# EAGLE design zhab-duino (EAGLE 7.5.0)
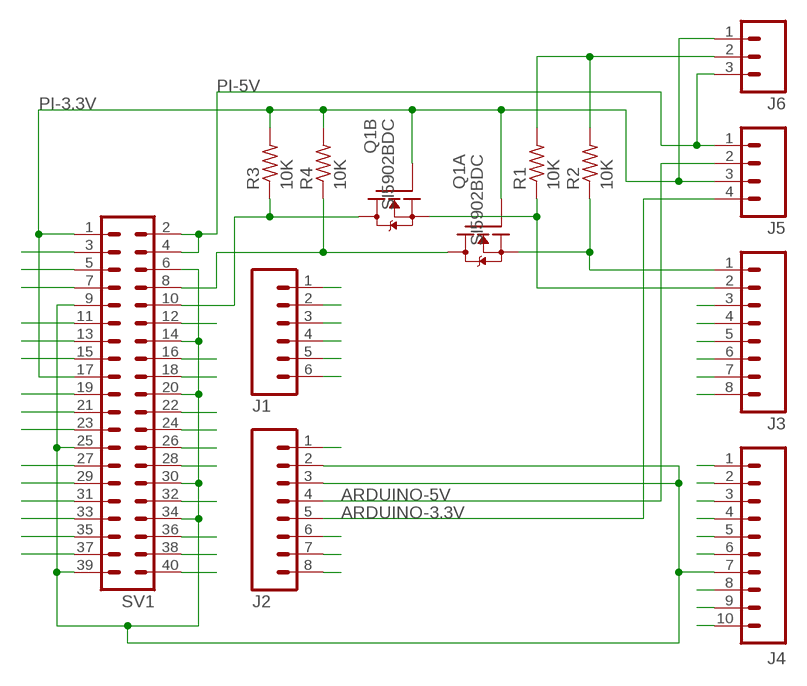
[diagram p0: schematic, sheet 1]

## Parts
J1  M06NO_SILK_FEMALE_PTH  [1X06_NO_SILK]
J2  M08NO_SILK_FEMALE_PTH  [1X08_NO_SILK]
J3  M08NO_SILK_FEMALE_PTH  [1X08_NO_SILK]
J4  M10NO_SILK_PTH_FEMALE  [1X10_NO_SILK]
J5  M04NO_SILK_ALL_ROUND  [1X04_NO_SILK_ALL_ROUND]
J6  M031X03_NO_SILK  [1X03_NO_SILK]
Q1  SI5902BDC  SI5902DC  [1206-8CHIP-FET]
R1  10K  R-US_M1206  [M1206]
R2  10K  R-US_M1206  [M1206]
R3  10K  R-US_M1206  [M1206]
R4  10K  R-US_M1206  [M1206]
SV1  MA20-2  [MA20-2]

## Nets
ARDUINO-3.3V: J2.5 J5.4
ARDUINO-5V: J2.4 J5.2
GND: J2.2 J2.3 J4.7 SV1.6 SV1.9 SV1.14 SV1.20 SV1.25 SV1.30 SV1.34 SV1.39
GPIO2: SV1.3
GPIO3: SV1.5
GPIO4: SV1.7
GPIO5: SV1.29
GPIO6: SV1.31
GPIO7: SV1.26
GPIO8: SV1.24
GPIO9: SV1.21
GPIO10: SV1.19
GPIO11: SV1.23
GPIO12: SV1.32
GPIO13: SV1.33
GPIO15: J3.2 Q1.3(B:S) R1.1
GPIO16: SV1.36
GPIO17: SV1.11
GPIO18: SV1.12
GPIO19: SV1.35
GPIO20: SV1.38
GPIO21: SV1.40
GPIO22: SV1.15
GPIO23: SV1.16
GPIO24: SV1.18
GPIO25: SV1.22
GPIO26: SV1.37
GPIO27: SV1.13
ID_SC: SV1.28
ID_SD: SV1.27
N$1: Q1.5(B:D) Q1.6(B:D) R3.1 SV1.10
N$2: J3.3
N$3: Q1.7(A:D) Q1.8(A:D) R4.1 SV1.8
N$4: J6.2 R1.2 R2.2
N$5: J3.4
N$6: J3.5
N$7: J3.1 Q1.1(A:S) R2.1
N$8: J3.6
N$9: J3.7
N$10: J3.8
N$12: J1.1
N$13: J1.2
N$14: J1.3
N$15: J1.4
N$16: J1.5
N$17: J1.6
N$18: J4.1
N$19: J4.2
N$20: J4.3
N$21: J4.4
N$22: J4.5
N$23: J4.6
N$24: J2.1
N$25: J2.6
N$26: J4.8
N$28: J2.7
N$29: J2.8
N$30: J4.9
N$31: J4.10
PI-3.3V: J5.3 J6.1 Q1.2(A:G) Q1.4(B:G) R3.2 R4.2 SV1.1 SV1.17
PI-5V: J5.1 J6.3 SV1.2 SV1.4

## Library data of the parts
J1 = SparkFun-Connectors:M06: Header 6 Standard 6-pin 0.1" header. Use with straight break away headers (SKU : PRT-00116), right angle break away headers (PRT-00553), swiss pins (PRT-00743), machine pins (PRT-00117), and female headers (PRT-00115). Molex polarized connector foot print use with SKU : PRT-08094 with associated crimp pins and housings. NOTES ON THE VARIANTS LOCK and LOCK_LONGPADS... This footprint was designed to help hold the alignment of a through-hole component (i.e. 6-pin header) while soldering it into place. You may notice that each hole has been shifted either up or down by 0.005 of an inch from it's more standard position (which is a perfectly straight line). This slight alteration caused the pins (the squares in the middle) to touch the edges of the holes. Because they are alternating, it causes a "brace" to hold the component in place. 0.005 has proven to be the perfect amount of "off-center" position when using our standard breakaway headers. Although looks a little odd when you look at the bare footprint, once you have a header in there, the alteration is very hard to notice. Also,if you push a header all the way into place, it is covered up entirely on the bottom side. This idea of altering the position of holes to aid alignment will be further integrated into the Sparkfun Library for other footprints. It can help hold any component with 3 or more connection pins.; PROD_ID: CONN-08437
J2 J3 = SparkFun-Connectors:M08: Header 8 Standard 8-pin 0.1" header. Use with straight break away headers (SKU : PRT-00116), right angle break away headers (PRT-00553), swiss pins (PRT-00743), machine pins (PRT-00117), and female headers (PRT-00115).; PROD_ID: CONN-08438
J4 = SparkFun-Connectors:M10: Header 10 Standard 10-pin 0.1" header. Use with straight break away headers (SKU : PRT-00116), right angle break away headers (PRT-00553), swiss pins (PRT-00743), machine pins (PRT-00117), and female headers (PRT-00115).; PROD_ID: CONN-11563
J5 = SparkFun-Connectors:M04: Header 4 Standard 4-pin 0.1" header. Use with straight break away headers (SKU : PRT-00116), right angle break away headers (PRT-00553), swiss pins (PRT-00743), machine pins (PRT-00117), and female headers (PRT-00115). Molex polarized connector foot print use with SKU : PRT-08231 with associated crimp pins and housings. 1MM SMD Version SKU: PRT-10208; PROD_ID: CONN-09696
J6 = SparkFun-Connectors:M03: Header 3 Standard 3-pin 0.1" header. Use with straight break away headers (SKU : PRT-00116), right angle break away headers (PRT-00553), swiss pins (PRT-00743), machine pins (PRT-00117), and female headers (PRT-00115). Molex polarized connector foot print use with SKU : PRT-08232 with associated crimp pins and housings.
Q1 = transistor-fet:SI5902DC: Dual N-Channel 30-V (D-S) MOSFET Source: http://www.vishay.com/docs/71053/71053.pdf
R1-R4 = resistor:R-US_: RESISTOR, American symbol
SV1 = con-lstb:MA20-2: PIN HEADER; OC_FARNELL: unknown; OC_NEWARK: unknown

## Board
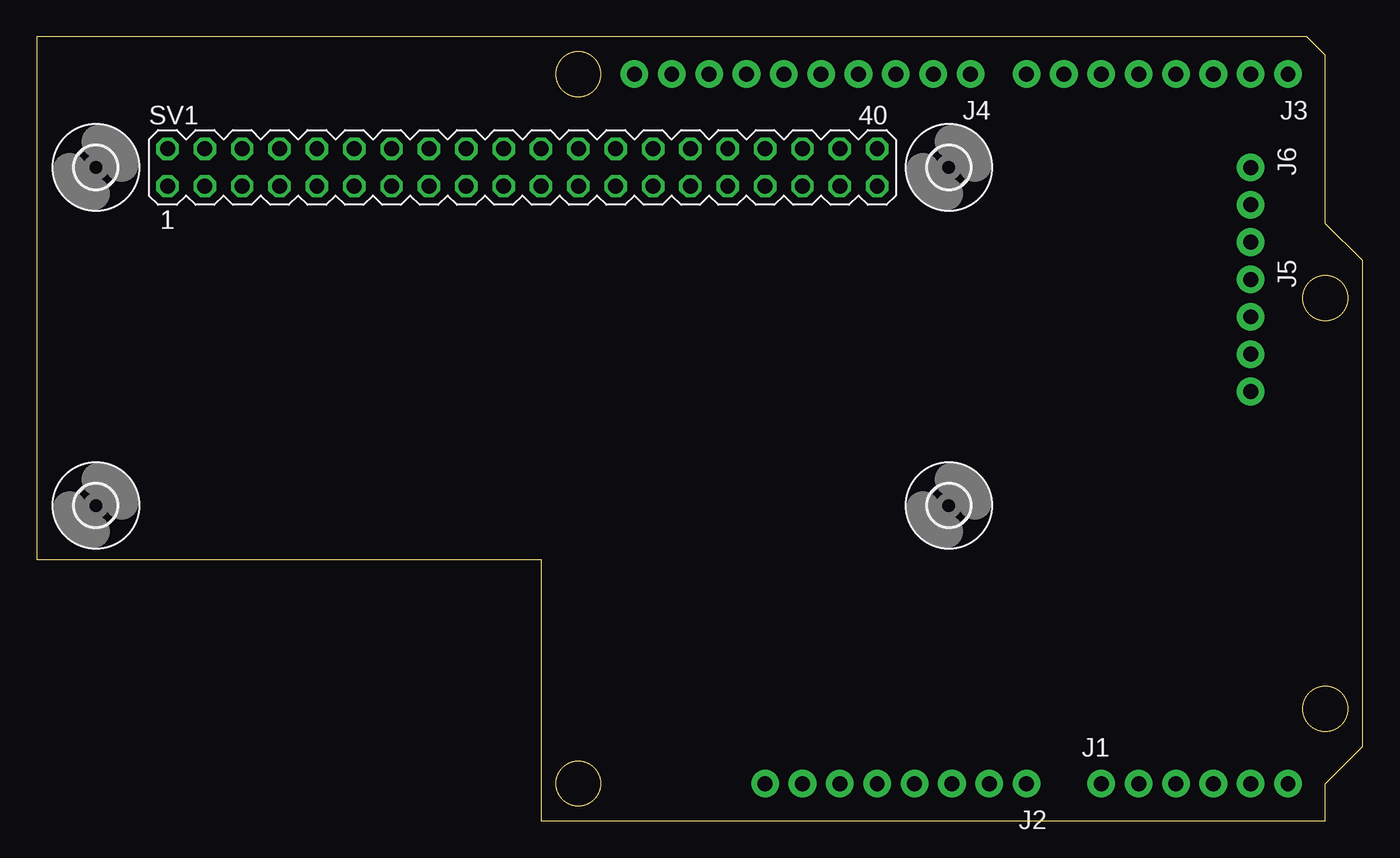
[diagram p1: board, top side]
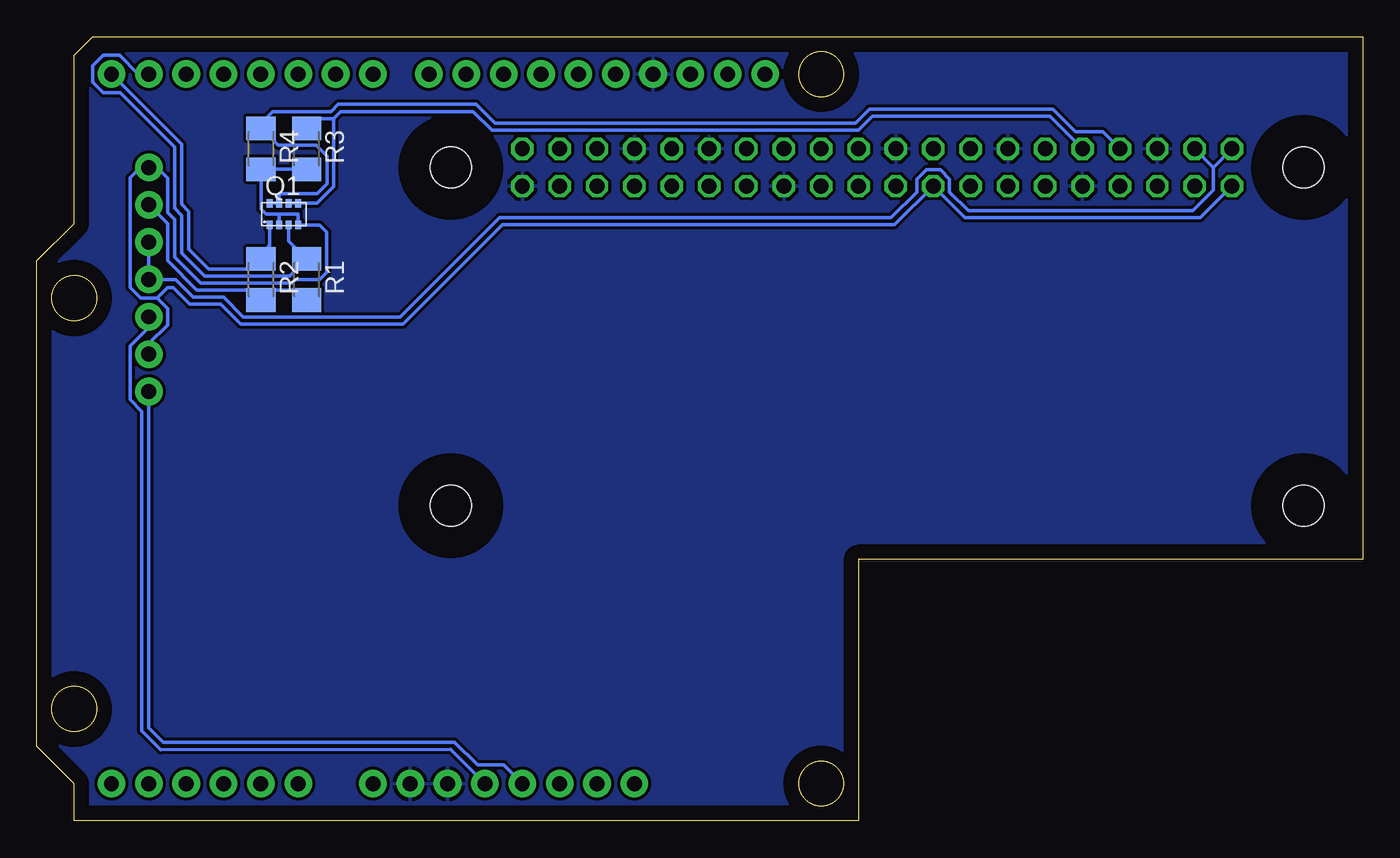
[diagram p2: board, bottom side, seen from below]

Size 90.17 x 53.34 mm. Coordinates in mm from the lower left corner, seen from the top.
Outline: 0,17.78 34.29,17.78 34.29,0 87.63,0 87.63,2.54 90.17,5.08 90.17,38.1 87.63,40.64 87.63,52.07 86.36,53.34 0,53.34 0,17.78
Outline: circle at 36.83,50.8 radius 1.52
Outline: circle at 87.63,35.56 radius 1.52
Outline: circle at 87.63,7.62 radius 1.52
Outline: circle at 36.83,2.54 radius 1.52
Copper layers (1*16): Top 0.035mm / dielectric 1.5mm / Bottom 0.035mm
Design rules "default": minimum track width 10mil, minimum drill 24mil, track to track 8mil, track to pad 8mil, pad to pad 8mil, via to via 8mil, smd to smd 8mil, copper to edge 40mil, drill to drill 8mil, minimum pad ring 10mil, minimum via ring 8mil, stop-mask expansion 4mil, vias tented up to drill 0mil, thermal gap 10mil

### Footprints (pad centres in the part's own frame; a part is rotated, then mirrored left to right if it is on the bottom)
1X06_NO_SILK = drill 1.016 pad 1.88: 1 0,0; 2 2.54,0; 3 5.08,0; 4 7.62,0; 5 10.16,0; 6 12.7,0
1X08_NO_SILK = drill 1.016 pad 1.88: 1 0,0; 2 2.54,0; 3 5.08,0; 4 7.62,0; 5 10.16,0; 6 12.7,0; 7 15.24,0; 8 17.78,0
1X10_NO_SILK = drill 1.016 pad 1.88: 1 0,0; 2 2.54,0; 3 5.08,0; 4 7.62,0; 5 10.16,0; 6 12.7,0; 7 15.24,0; 8 17.78,0; 9 20.32,0; 10 22.86,0
1X04_NO_SILK_ALL_ROUND = drill 1.016 pad 1.88: 1 0,0; 2 2.54,0; 3 5.08,0; 4 7.62,0
1X03_NO_SILK = drill 1.016 pad 1.88: 1 0,0; 2 2.54,0; 3 5.08,0
1206-8CHIP-FET = smd 0.406 x 0.56: 1 -0.975,-0.737; 2 -0.325,-0.737; 3 0.325,-0.737; 4 0.975,-0.737; 5 0.975,0.737; 6 0.325,0.737; 7 -0.325,0.737; 8 -0.975,0.737
M1206 = smd 1.6 x 2: 1 -1.4,0; 2 1.4,0
MA20-2 = drill 1.016 octagon: 1 -24.13,-1.27; 2 -24.13,1.27; 3 -21.59,-1.27; 4 -21.59,1.27; 5 -19.05,-1.27; 6 -19.05,1.27; 7 -16.51,-1.27; 8 -16.51,1.27; 9 -13.97,-1.27; 10 -13.97,1.27; 11 -11.43,-1.27; 12 -11.43,1.27; 13 -8.89,-1.27; 14 -8.89,1.27; 15 -6.35,-1.27; 16 -6.35,1.27; 17 -3.81,-1.27; 18 -3.81,1.27; 19 -1.27,-1.27; 20 -1.27,1.27; 21 1.27,-1.27; 22 1.27,1.27; 23 3.81,-1.27; 24 3.81,1.27; 25 6.35,-1.27; 26 6.35,1.27; 27 8.89,-1.27; 28 8.89,1.27; 29 11.43,-1.27; 30 11.43,1.27; 31 13.97,-1.27; 32 13.97,1.27; 33 16.51,-1.27; 34 16.51,1.27; 35 19.05,-1.27; 36 19.05,1.27; 37 21.59,-1.27; 38 21.59,1.27; 39 24.13,-1.27; 40 24.13,1.27
2,8 = hole 2.8: 0,0

### Placement (x,y rotation side)
J1  72.39,2.54 0 top
J2  67.31,2.54 180 top
J3  85.09,50.8 180 top
J4  63.5,50.8 180 top
J5  82.55,36.83 270 top
J6  82.55,44.45 270 top
Q1  73.37,41.27 0 bottom
R1  71.82,36.83 270 bottom
R2  74.91,36.83 270 bottom
R3  71.82,45.72 270 bottom
R4  74.91,45.72 270 bottom
SV1  33.02,44.45 0 top
U$1  [2,8]  4.02,21.45 0 top
U$2  [2,8]  4.02,44.45 0 top
U$3  [2,8]  62.02,44.45 0 top
U$4  [2,8]  62.02,21.45 0 top

### Tracks (layer width: path | path; a pad name or v marks a point on that pad's centre or on a via)
ARDUINO-3.3V
  Bottom 0.254: J2.5 58.42,3.81 60.21,3.81 61.75,5.35 81.57,5.35 82.55,6.33 J5.4
ARDUINO-5V
  Bottom 0.254: J2.4 62.02,4.87 81.73,4.83 83.03,6.13 83.03,27.86 83.82,28.65 83.82,32.31 82.55,33.58 J5.2
GND
  pour Bottom: 0,17.78 34.29,17.78 34.29,0 87.63,0 87.63,2.54 90.17,5.08 90.17,38.1 87.63,40.64 87.63,52.07 86.36,53.34 82.55,53.34 0.23,53.46
GPIO15
  Bottom 0.254: Q1.3 73.04,39.45 R1.1 72.98,37.07 78.76,37.07 80.31,38.62 80.31,41.18 80.8,41.67 80.79,45.82 84.5,49.53 85.65,49.53 86.36,50.24 86.36,51.36 85.65,52.07 84.53,52.07 83.26,50.8 J3.2
N$1
  Bottom 0.254: SV1.10 21.27,47.94 33.34,47.94 34.29,46.99 59.21,46.99 60.48,48.26 69.49,48.26 69.97,47.78 | Q1.6 Q1.5 71.1,42.01 69.97,43.14 69.97,47.78 | 69.97,47.78 71.83,47.78 71.82,47.77 R3.1
N$3
  Bottom 0.254: SV1.8 17.66,46.87 19.53,46.87 21.07,48.42 33.54,48.42 34.49,47.47 59.02,47.47 60.28,48.74 69.69,48.74 70.17,48.26 74.12,48.26 74.91,47.47 R4.1 73.76,45.96 71.18,45.96 70.43,45.2 70.43,43.34 71.1,42.66 73.69,42.66 Q1.7 Q1.8
N$4
  Bottom 0.254: J6.2 81.28,40.64 81.28,38.1 79.3,36.12 74.91,36.12 | R2.2 74.91,36.12 | 74.91,36.12 71.82,36.12 R1.2
N$7
  Bottom 0.254: Q1.1 74.34,39.16 R2.1 75.37,38.23 75.37,37.54 78.49,37.54 79.83,38.89 79.83,41.46 80.33,41.95 80.31,46.02 J3.1
PI-3.3V
  Bottom 0.254: Q1.2 73.69,41.27 | 73.69,41.27 72.39,41.27 Q1.4 72.38,40.52 70.94,40.52 70.47,40.05 70.47,37.28 70.92,36.83 72.55,36.83 72.79,36.59 79.02,36.59 80.8,38.34 80.8,40.92 81.28,41.39 81.28,43.74 81.99,44.45 J6.1 83.13,44.45 83.82,43.76 83.82,36.27 83.11,35.56 81.99,35.56 | 72.09,44.13 R3.2 R4.2 74.91,41.63 74.56,41.27 73.69,41.27 | J5.3 82.55,32.46 81.28,33.73 81.28,34.85 81.99,35.56 | SV1.1 11.03,41.04 27.07,41.04 SV1.17 31.83,40.56 58.5,40.56 65.25,33.81 76.32,33.81 77.67,35.16 79.77,35.16 80.88,36.27 81.28,36.27 81.99,35.56
PI-5V
  Bottom 0.254: SV1.2 10.16,44.45 | SV1.4 10.16,44.45 | 10.16,44.45 10.16,42.9 11.55,41.51 26.83,41.51 28.1,42.78 28.1,43.66 28.73,44.29 29.69,44.29 30.32,43.66 30.32,42.78 32.07,41.04 58.7,41.04 65.44,34.29 76.12,34.29 77.47,35.64 79.53,35.64 80.72,36.83 J5.1 J6.3